# Altium schematic sheet Блок1.2.SchDoc
size A4; DocumentNumber: 4; SheetNumber: 4; SheetTotal: 12
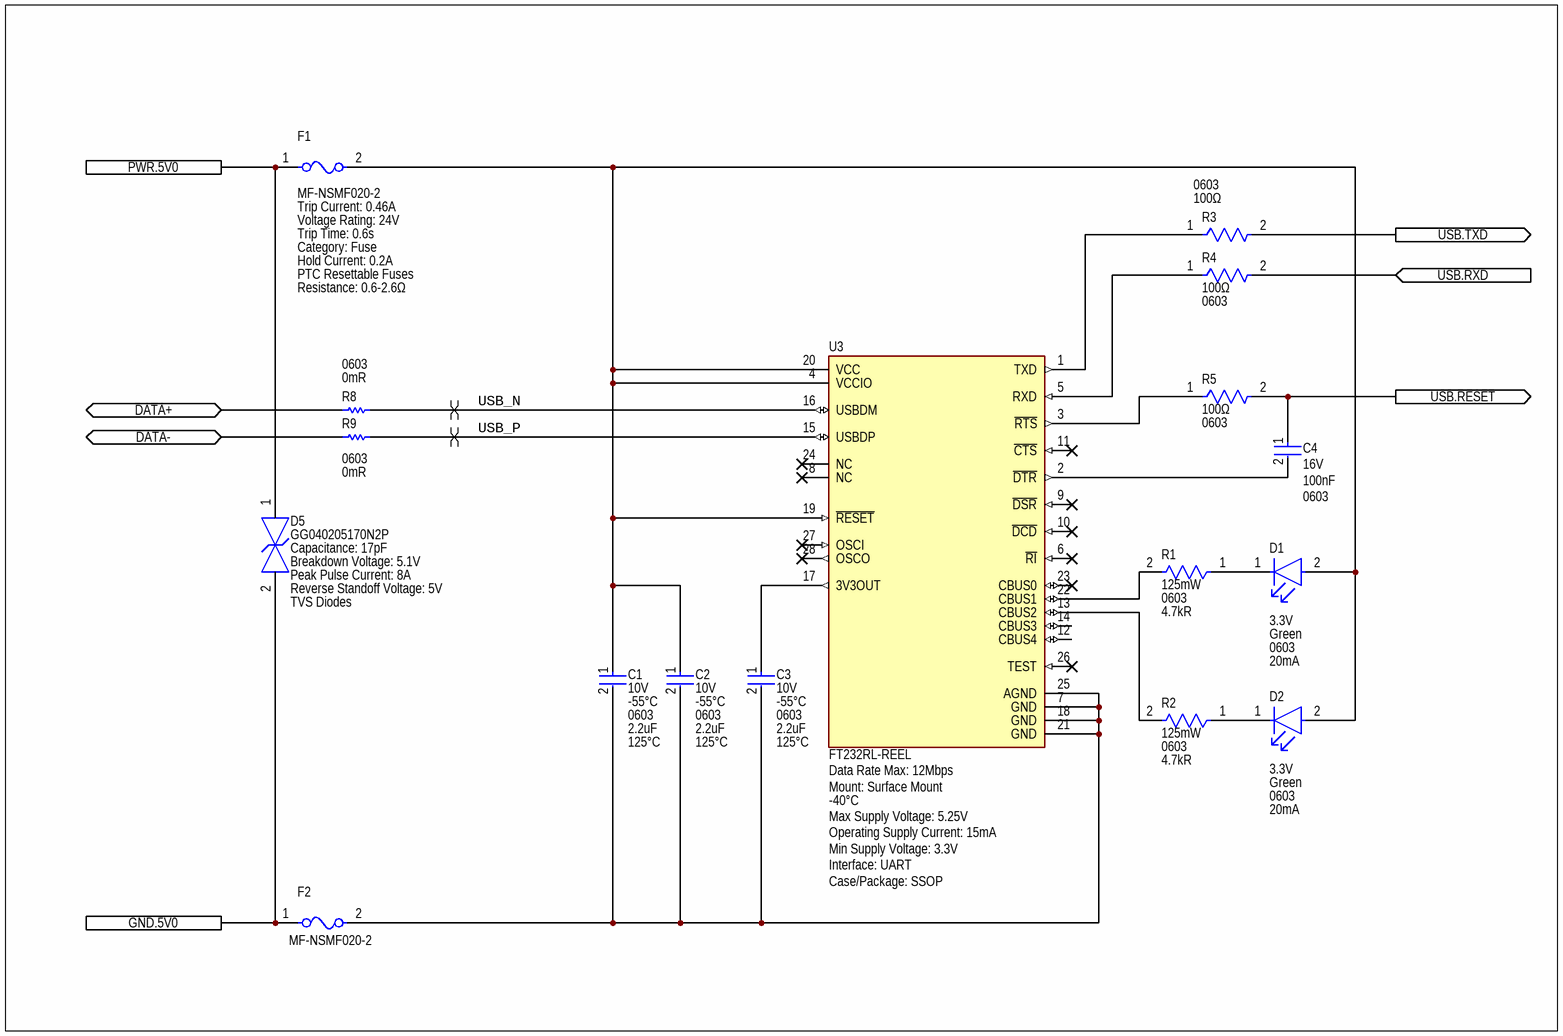
[diagram p0: Блок1.2.SchDoc]

## Parts
C1  Voltage Rating: 10V  Min Operating Temperature: -55°C  Case Code (Imperial): 0603  Capacitance: 2.2uF  Max Operating Temperature: 125°C  [FP-CL10-IPC_A]  (hidden comment: CL10B225KP8NFNC)
C2  Voltage Rating: 10V  Min Operating Temperature: -55°C  Case Code (Imperial): 0603  Capacitance: 2.2uF  Max Operating Temperature: 125°C  [FP-CL10-IPC_A]  (hidden comment: CL10B225KP8NFNC)
C3  Voltage Rating: 10V  Min Operating Temperature: -55°C  Case Code (Imperial): 0603  Capacitance: 2.2uF  Max Operating Temperature: 125°C  [FP-CL10-IPC_A]  (hidden comment: CL10B225KP8NFNC)
C4  Voltage Rating (DC): 16V  Capacitance: 100nF  Case/Package: 0603  [FP-CL10-IPC_B]  (hidden comment: CL10B104JO8NNND)
D1  Forward Voltage: 3.3V  Color: Green  Case/Package: 0603  Forward Current: 20mA  [FP-APT1608ZGCK-MFG]  (hidden comment: APT1608ZGCK)
D2  Forward Voltage: 3.3V  Color: Green  Case/Package: 0603  Forward Current: 20mA  [FP-APT1608ZGCK-MFG]  (hidden comment: APT1608ZGCK)
D5  GG040205170N2P  Capacitance: 17pF  Breakdown Voltage: 5.1V  Peak Pulse Current: 8A  Reverse Standoff Voltage: 5V  Device Class L2: TVS Diodes  [FP-GG0402-IPC_A]
F1  MF-NSMF020-2  Trip Current: 0.46A  Voltage Rating: 24V  Trip Time: 0.6s  Category: Fuse  Hold Current: 0.2A  Device Class L2: PTC Resettable Fuses  Resistance: 0.6-2.6Ω  [FP-MF-NSMF020-2-MFG]
F2  MF-NSMF020-2  [FP-MF-NSMF020-2-MFG]
R1  Power Rating: 125mW  Case/Package: 0603  Resistance: 4.7kR  [FP-MCT0603-MFG]  (hidden comment: MCT06030C4701FP500)
R2  Power Rating: 125mW  Case/Package: 0603  Resistance: 4.7kR  [FP-MCT0603-MFG]  (hidden comment: MCT06030C4701FP500)
R3  Resistance: 100Ω  Package: 0603  [FP-RT0603-IPC_A]  (hidden comment: RT0603FRE07100RL)
R4  Resistance: 100Ω  Package: 0603  [FP-RT0603-IPC_A]  (hidden comment: RT0603FRE07100RL)
R5  Resistance: 100Ω  Package: 0603  [FP-RT0603-IPC_A]  (hidden comment: RT0603FRE07100RL)
R8  PackageReference: 0603  Resistance: 0mR  [RESC1609X50X30NL8T20]  (hidden comment: CRCW06030000Z0EA)
R9  PackageReference: 0603  Resistance: 0mR  [RESC1609X50X30NL8T20]  (hidden comment: CRCW06030000Z0EA)
U3  FT232RL-REEL  Data Rate Max: 12Mbps  Mount: Surface Mount  Min Operating Temperature: -40°C  Max Supply Voltage: 5.25V  Operating Supply Current: 15mA  Min Supply Voltage: 3.3V  Interface: UART  Case/Package: SSOP  [FP-SSOP-28-MFG]

## Ports
DATA+ (bidir), DATA- (bidir), GND.5V0, PWR.5V0, USB.RESET (out), USB.RXD (in), USB.TXD (out)

## Nets
DATA+: R8.1 ; port DATA+
DATA-: R9.1 ; port DATA-
GND.5V0: D5.2 F2.1 ; port GND.5V0
PWR.5V0: D5.1 F1.1 ; port PWR.5V0
USB.RESET: C4.1 R5.2 ; port USB.RESET
USB.RXD: R4.2 ; port USB.RXD
USB.TXD: R3.2 ; port USB.TXD
USB_N: R8.2 U3.16(USBDM)
USB_P: R9.2 U3.15(USBDP)
NetC1_1: C1.1 C2.1 D1.2(A) D2.2(A) F1.2 U3.4(VCCIO) U3.19(~{RESET}) U3.20(VCC)
NetC1_2: C1.2 C2.2 C3.2 F2.2 U3.7(GND) U3.18(GND) U3.21(GND) U3.25(AGND)
NetC3_1: C3.1 U3.17(3V3OUT)
NetC4_2: C4.2 U3.2(~{DTR})
NetD1_1: D1.1(C) R1.1
NetD2_1: D2.1(C) R2.1
NetR1_2: R1.2 U3.22(CBUS1)
NetR2_2: R2.2 U3.13(CBUS2)
NetR3_1: R3.1 U3.1(TXD)
NetR4_1: R4.1 U3.5(RXD)
NetR5_1: R5.1 U3.3(~{RTS})

Not connected (* = marked no-connect by the designer): U3 6(~{RI})* 8(NC)* 9(~{DSR})* 10(~{DCD})* 11(~{CTS})* 12(CBUS4) 14(CBUS3) 23(CBUS0)* 24(NC)* 26(TEST)* 27(OSCI)* 28(OSCO)*

## Layout directives
differential pair: USB_N, USB_P

## Library data of the parts
C1-C3 = CMP-13271-000561-1: Cap Ceramic 2.2uF 10V X7R ±10% Pad SMD 0603 +125°C T/R; Thickness: 0.035inch; Radiation Hardening: No; Mount: Surface Mount; Dielectric: X7R; Case Code (Metric): 1608; Package Quantity: 1; Width: 0.031inch; Case/Package: 0603; Height: 0.8mm; Depth: 0.8mm; Packaging: Tape and Reel; Length: 0.063inch; Tolerance: 10%
C4 = CMP-13271-003283-1: Cap Ceramic 100nF 16V X7R ±5% Pad SMD 0603 +125°C T/R; Material: Ceramic; Max Operating Temperature: 125°C; Lead Free: Lead Free; Radiation Hardening: No; Mount: Surface Mount; Voltage Rating: 16V; Height: 0.8mm; Min Operating Temperature: -55°C; Tolerance: 5%; Width: 0.031inch; Packaging: Tape and Reel; Depth: 0.8mm; Package Quantity: 10000; Length: 1.6mm; Thickness: 0.035inch; Dielectric: X7R
D1 D2 = CMP-44529-000024-1: LED GREEN CLEAR CHIP SMD; Dominant Wavelength: 525nm; Lens Color: Colorless; Viewing Angle: 120°; Luminous Intensity: 350mcd; Lens Transparency: Clear; Max Operating Temperature: 85°C; Mount: Surface Mount; Min Operating Temperature: -40°C; Case Code (Metric): 1608; Test Current: 20mA; Packaging: Tape and Reel; Width: 0.8mm; Package Quantity: 1; Height: 0.75mm; Length: 1.6mm; Illumination Color: Green; Lead Free: Lead Free; Case Code (Imperial): 0603
D5 = CMP-04587-000002-1: TVS DIODE 5V 10V 0402; Manufacturer: AVX; Peak Pulse Power: 80W; Value: 17pF; Number Of Channels: 1; Direction: Bidirectional; Manufacturer Part Number: GG040205170N2P; Temperature: -55°C to +125°C; Octopart: https://octopart.com/gg040205170n2p-avx-81066082; RoHS: TRUE; Clamping Voltage: 10V; Device Class L1: Circuit Protection; ComponentLink2Description: Datasheet; Category: Diode; Package: GG0402; Temperature Range High: +125°C; Digikey Description: TVS DIODE 5V 10V 0402; Ipc Land Pattern Name: DIOC10060X50; Device Class L3: unset; Automotive: No; Mouser Description: ESD Suppressor TVS Bi-Dir 5V 2-Pin Case 0402(1006Metric) T/R; ComponentLink2URL: http://datasheets.avx.com/AVX-GiGuard.pdf; Height: 0.55mm; Lead Free: Yes; Temperature Range Low: -55°C
F1 = CMP-07400-000029-1: PTC RESET FUSE 24V 200MA 1206; Manufacturer: Bourns; Current Rating: 10A; Automotive Grade: Grade 3; Value: 0.6-2.6Ω; Ambient Temperature Range Low: -40°C; Device Class L1: Circuit Protection; Temperature Range Low: -40°C; Temperature: -40°C to +85°C; Temperature Range High: +85°C; Mouser Description: Resettable Fuses - PPTC 0.20A 24V 0.60ohm MAX (R); Device Class L3: unset; RoHS: TRUE; Package: MF-NSMF020-2; Ambient Temperature Range High: +85°C; ComponentLink2Description: Datasheet; Digikey Description: PTC RESET FUSE 24V 200MA 1206; Manufacturer Part Number: MF-NSMF020-2; Octopart: https://octopart.com/mf-nsmf020-2-bourns-94649; Automotive: Yes; Height: 0.85mm; Lead Free: Yes; ComponentLink2URL: https://www.bourns.com/docs/Product-Datasheets/mfnsmf.pdf
F2 = CMP-07400-000029-1: PTC RESET FUSE 24V 200MA 1206; Manufacturer: Bourns; Trip Current: 0.46A; Trip Time: 0.6s; Hold Current: 0.2A; Current Rating: 10A; Resistance: 0.6-2.6Ω; Automotive Grade: Grade 3; Value: 0.6-2.6Ω; Voltage Rating: 24V; Ambient Temperature Range Low: -40°C; Device Class L1: Circuit Protection; Temperature Range Low: -40°C; Temperature: -40°C to +85°C; Category: Fuse; Temperature Range High: +85°C; Mouser Description: Resettable Fuses - PPTC 0.20A 24V 0.60ohm MAX (R); Device Class L3: unset; RoHS: TRUE; Package: MF-NSMF020-2; Ambient Temperature Range High: +85°C; ComponentLink2Description: Datasheet; Digikey Description: PTC RESET FUSE 24V 200MA 1206; Device Class L2: PTC Resettable Fuses; Manufacturer Part Number: MF-NSMF020-2; Octopart: https://octopart.com/mf-nsmf020-2-bourns-94649; Automotive: Yes; Height: 0.85mm; Lead Free: Yes; ComponentLink2URL: https://www.bourns.com/docs/Product-Datasheets/mfnsmf.pdf
R1 R2 = CMP-02407-001733-1: RES SMD 100 OHM 1% 1/8W 0603; Voltage Rating: 75V; Temperature Coefficient: 50ppm/°C; Length: 1.55mm; Composition: Thin Film; Mount: Surface Mount; Max Operating Temperature: 125°C; Width: 0.033inch; Radiation Hardening: No; Depth: 0.85mm; Military Standard: Not; Case Code (Imperial): 0603; Case Code (Metric): 1608; Contact Plating: Tin; Packaging: Tape and Reel; Tolerance: 1%; Lead Free: Lead Free; REACH SVHC: No SVHC; Max Power Dissipation: 125mW; Min Operating Temperature: -55°C; Package Quantity: 1; Number of Terminations: 2; Voltage Rating (DC): 75V; Height: 0.022inch
R3-R5 = CMP-03412-022806-1: RES SMD 100 OHM 1% 1/10W 0603; Manufacturer: Yageo; Value: 100Ω; Power Rating: 0.1W; Voltage Rating: 75V; Temperature Coefficient: 50 ppm/°C; Tolerance: 0.01; Manufacturer Part Number: RT0603FRE07100RL; Mouser Description: Thin Film Resistors - SMD 1/10W 100 ohm 1% 50ppm; Ipc Land Pattern Name: RESC16080X45; Height: 0.55mm; Category: Res; Temperature Range Low: -55°C; Lead Free: Yes; Automotive: No; Device Class L3: Chip SMD Resistors; ComponentLink2Description: Datasheet; Device Class L2: Resistors; RoHS: TRUE; Footprint Url: http://www.yageo.com/exep/pages/download/literatures/PYu-R_Mount_10.pdf; Digikey Description: RES SMD 100 OHM 1% 1/10W 0603; Temperature Range High: +155°C; Device Class L1: Passive Components; Series: RT; Temperature: -55°C to +155°C; Octopart: https://octopart.com/rt0603fre07100rl-yageo-39792638; Composition: Thin Film; ComponentLink2URL: http://www.yageo.com/documents/recent/PYu-RT_1-to-0.01_RoHS_L_9.pdf
R8 R9 = CMP-2000-03816-5: Chip Resistor, 0 Ohm, Jumper, 100 mW, -55 to 155 degC, 0603 (1608 Metric), RoHS, Tape and Reel; Manufacturer: Vishay; Manufacturer Part Number: CRCW0603-0000Z0EA; Voltage Rating: 75V; Current Rating: 2A; Max Power Dissipation: 100mW; Temperature Coefficient: 100ppm/°C; Tolerance: 5%; Package Quantity: 5000; DatasheetVersion: 06/2012; Min Operating Temperature: -55°C; ComponentLink1URL: http://www.vishay.com/; Mounting Technology: Surface Mount; Height: 0.45mm; ComponentLink1Description: Manufacturer URL; REACH SVHC: Unknown; Packaging: Cut Tape; Max Operating Temperature: 155°C; Mount: Surface Mount; ComponentLink2Description: Datasheet; PackageDescription: 2-Pin Surface Mount Device, Body 1.575 x 0.85 mm; Length: 1.55mm; ComponentLink2URL: http://www.vishay.com/docs/20035/dcrcwe3.pdf; Pins: 2; RoHSCompliant: true; Case Code (Imperial): 0603; Case Code (Metric): 1608; Case/Package: 0603; Category: Chip SMD Resistors; Contact Plating: Tin,Lead; Depth: 0.85mm; Features: Automotive AEC-Q200; Lead Free: Lead Free; Military Standard: Not; Number of Terminations: 2; Power Rating: 100mW; Radiation Hardening: No; Resistor Type: Thick Film; Series: D/CRCW E3; Technology: THICK FILM; Termination: SMD/SMT; Voltage Rating (DC): 75V; Weight: 0.000917oz; Width: 0.85mm; Working Voltage: 75V
U3 = CMP-0078-00029-4: IC USB FS SERIAL UART 28-SSOP; Number of Channels: 1; Voltage: 5V; Radiation Hardening: No; Package Quantity: 2000; Number of Transceivers: 1; Width: 5.3mm; Number of Pins: 28; Height: 1.75mm; Weight: 0.080001oz; Lead Free: Lead Free; Length: 10.2mm; REACH SVHC: No SVHC; Max Operating Temperature: 85°C; Packaging: Tape and Reel